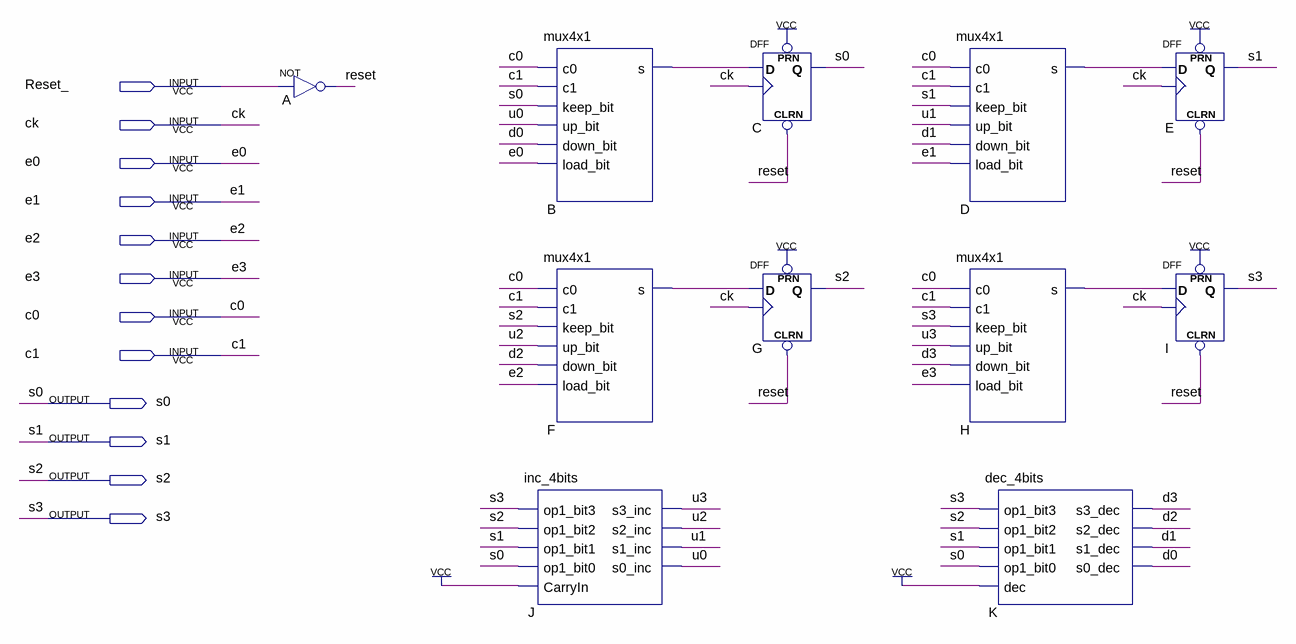
[diagram p0: schematic sheet]
// Quartus schematic ContadorSincrono.bdf as structural Verilog: 11 symbols, 12 pins
module ContadorSincrono (
  input  Reset_,
  input  ck,
  input  e0,
  input  e1,
  input  e2,
  input  e3,
  input  c0,
  input  c1,
  output s0,
  output s1,
  output s2,
  output s3
);

  wire B_s, d0, d1, d2, d3, D_s, F_s, H_s, reset, u0, u1, u2, u3;

  not A (reset, Reset_);
  mux4x1 B (.c0(c0), .c1(c1), .keep_bit(s0), .up_bit(u0), .down_bit(d0), .load_bit(e0), .s(B_s));
  mux4x1 F (.c0(c0), .c1(c1), .keep_bit(s2), .up_bit(u2), .down_bit(d2), .load_bit(e2), .s(F_s));
  inc_4bits J (
    .op1_bit3(s3), .op1_bit2(s2), .op1_bit1(s1), .op1_bit0(s0), .CarryIn(1'b1), .s3_inc(u3), .s2_inc(u2),
    .s1_inc(u1), .s0_inc(u0));
  DFF C (.CLRN(reset), .CLK(ck), .D(B_s), .PRN(1'b1), .Q(s0));
  DFF G (.CLRN(reset), .CLK(ck), .D(F_s), .PRN(1'b1), .Q(s2));
  mux4x1 D (.c0(c0), .c1(c1), .keep_bit(s1), .up_bit(u1), .down_bit(d1), .load_bit(e1), .s(D_s));
  mux4x1 H (.c0(c0), .c1(c1), .keep_bit(s3), .up_bit(u3), .down_bit(d3), .load_bit(e3), .s(H_s));
  dec_4bits K (
    .op1_bit3(s3), .op1_bit2(s2), .op1_bit1(s1), .op1_bit0(s0), .dec(1'b1), .s3_dec(d3), .s2_dec(d2),
    .s1_dec(d1), .s0_dec(d0));
  DFF E (.CLRN(reset), .CLK(ck), .D(D_s), .PRN(1'b1), .Q(s1));
  DFF I (.CLRN(reset), .CLK(ck), .D(H_s), .PRN(1'b1), .Q(s3));
endmodule
